# EAGLE design bridge-pcb (EAGLE 7.7.0)
REVISION: A
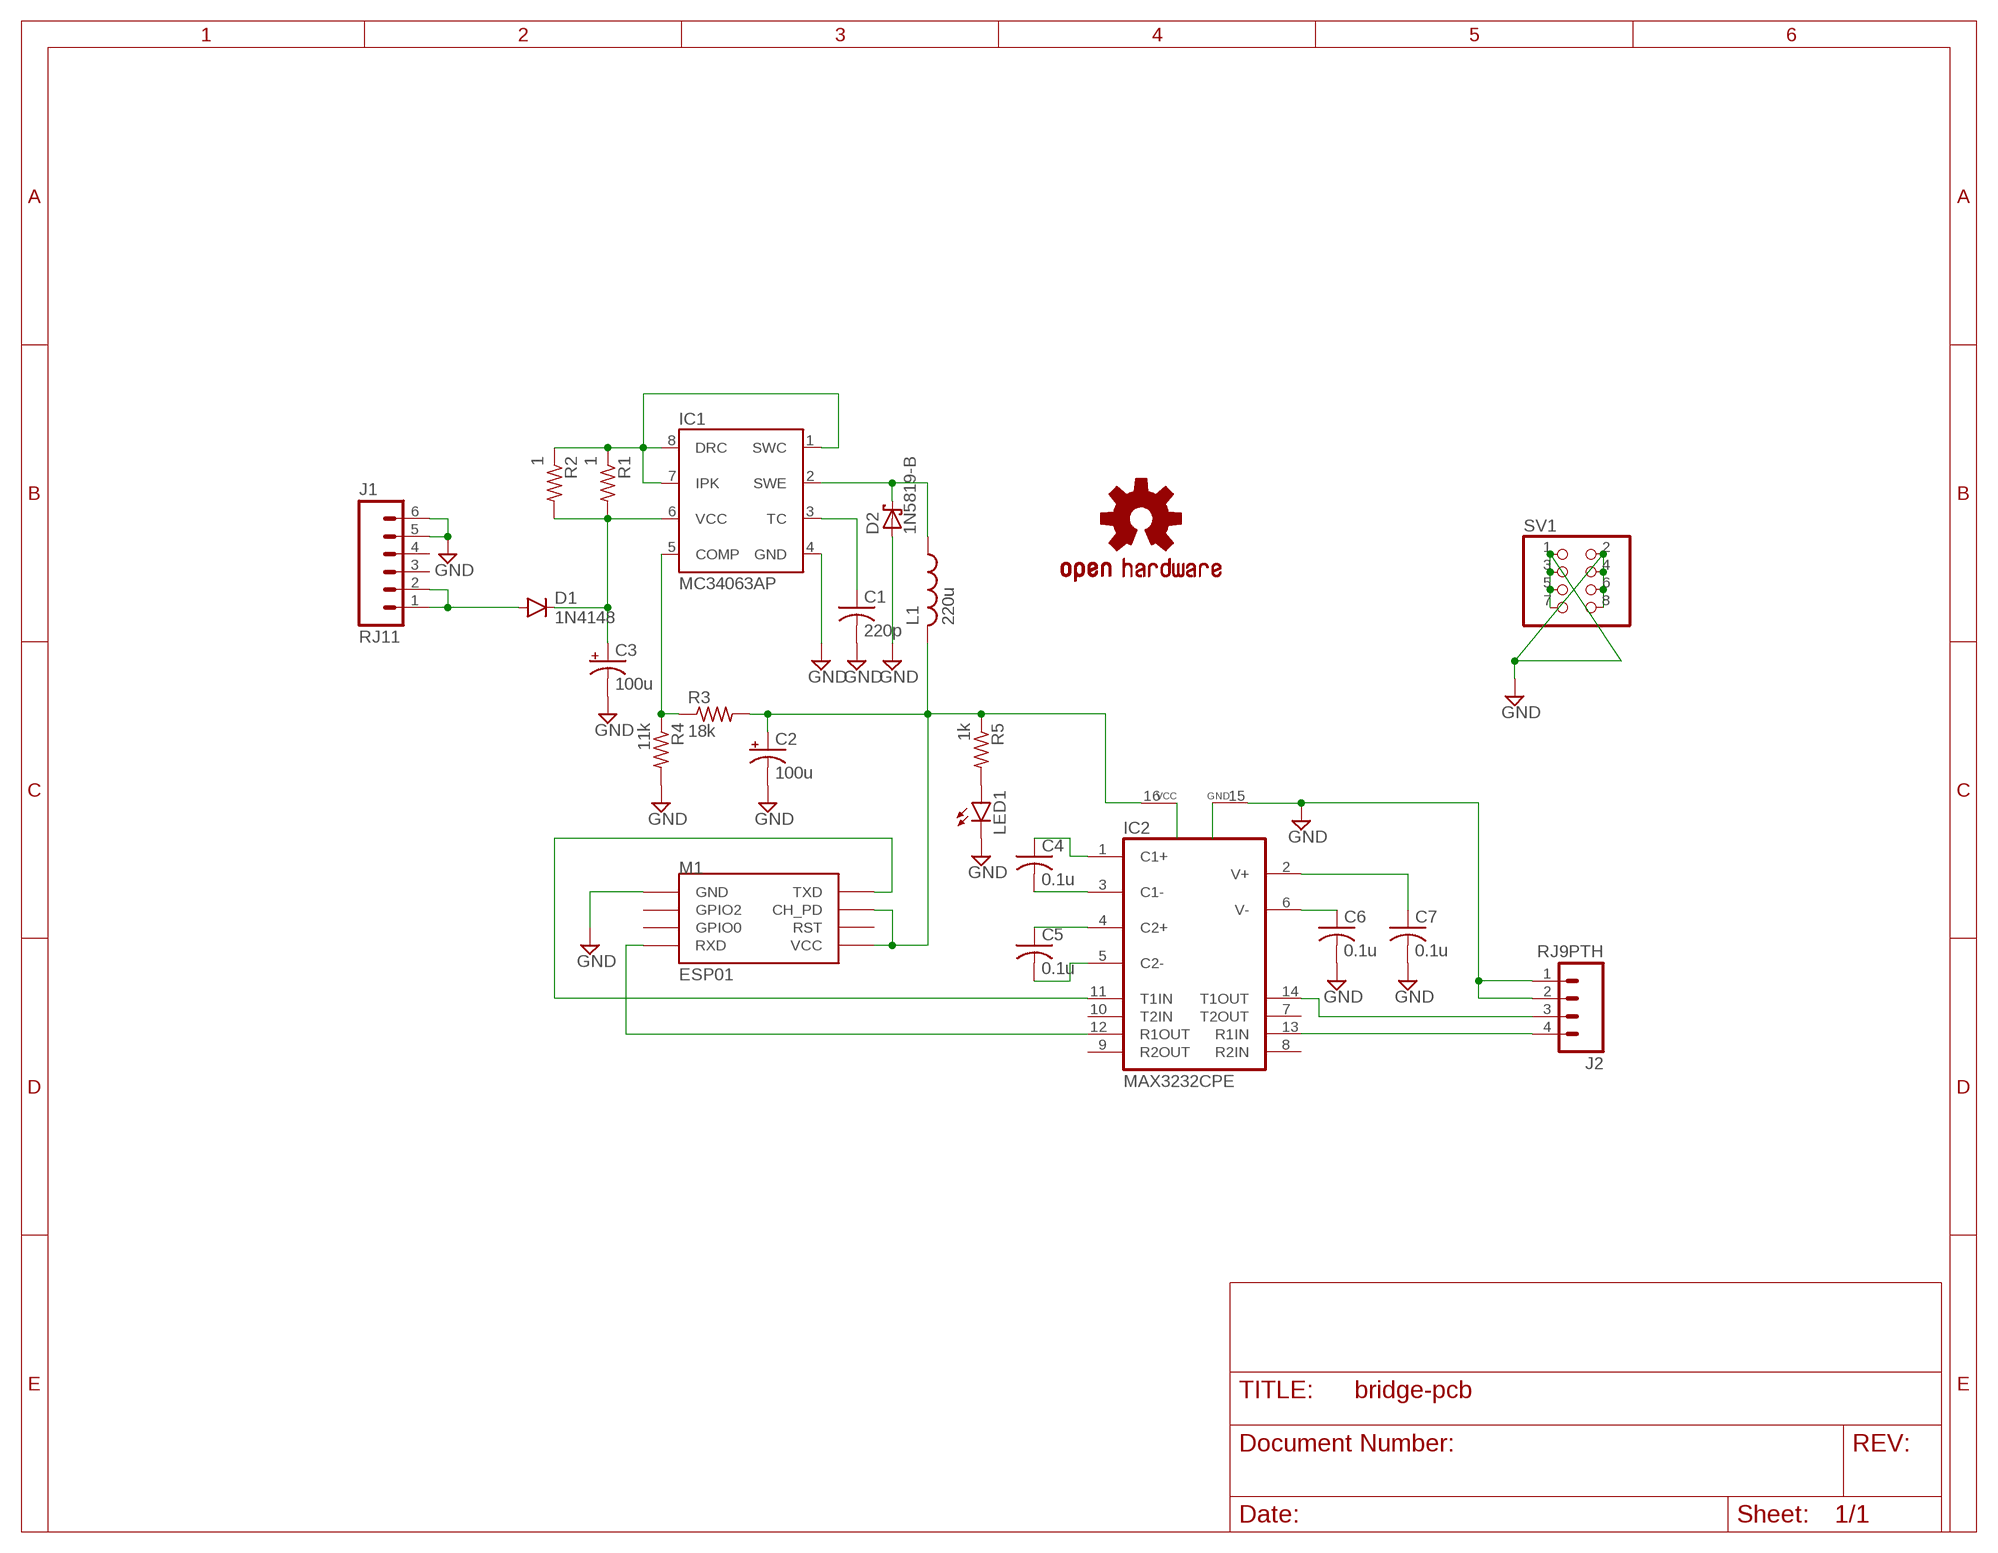
[diagram p0: schematic, sheet 1]
FRAME1 (FRAME_A_L): DESCRIPTION: Wi-Fi to RS-232 bridge; REVISION: A

## Parts
C1  220p  C-US025-024X044  [C025-024X044]
C2  100u  CPOL-USE2.5-5  [E2,5-5]
C3  100u  CPOL-USE2.5-5  [E2,5-5]
C4  0.1u  C-US025-024X044  [C025-024X044]
C5  0.1u  C-US025-024X044  [C025-024X044]
C6  0.1u  C-US025-024X044  [C025-024X044]
C7  0.1u  C-US025-024X044  [C025-024X044]
D1  1N4148  DIODE1N4148  [DIODE-1N4148]
D2  1N5819-B  [DO41-7.6]
IC1  MC34063AP  [DIL-08]
IC2  MAX3232CPE  [DIL16]
J1  RJ11  RJ11-6PTH  [RJ11-6]
J2  RJ9PTH  [RJ9]
L1  220u  L-US6000-XXX-RC  [6000-XXXX-RC]
LED1  LED5MM  [LED5MM]
LOGO1  OSHW-LOGOM  [OSHW-LOGO-M]
M1  ESP01  [ESP01]
R1  1  R-US_0204/2V  [0204V]
R2  1  R-US_0204/2V  [0204V]
R3  18k  R-US_0204/2V  [0204V]
R4  11k  R-US_0204/2V  [0204V]
R5  1k  R-US_0204/7  [0204/7]
SV1  PINHD-2X4  [2X04]

## Nets
3V3 [supply]: C2.+ IC2.16(VCC) L1.2 M1.CH_PD M1.VCC R3.2 R5.1
12V [supply]: C3.+ D1.C IC1.6(VCC) R1.2 R2.2
GND: C1.2 C2.- C3.- C6.2 C7.2 D2.A IC1.4(GND) IC2.15(GND) J1.5 J1.6 J2.1 J2.2 LED1.K(C) M1.GND R4.2 SV1.1 SV1.2 SV1.3 SV1.4 SV1.5 SV1.6 SV1.7 SV1.8
N$3: C1.1 IC1.3(TC)
N$4: LED1.A R5.2
N$5: D2.C IC1.2(SWE) L1.1
N$6: IC2.11(T1IN) M1.TX(TXD)
N$7: IC2.12(R1OUT) M1.RX(RXD)
N$8: C4.2 IC2.3(C1-)
N$9: C4.1 IC2.1(C1+)
N$10: C5.1 IC2.4(C2+)
N$11: C5.2 IC2.5(C2-)
N$12: C6.1 IC2.6(V-)
N$13: C7.1 IC2.2(V+)
N$14: IC2.14(T1OUT) J2.3
N$15: IC2.13(R1IN) J2.4
N$16: IC1.1(SWC) IC1.7(IPK) IC1.8(DRC) R1.1 R2.1
N$18: IC1.5(COMP) R3.1 R4.1
VBATT [supply]: D1.A J1.1 J1.2
Unconnected: IC2.7(T2OUT) IC2.8(R2IN) IC2.9(R2OUT) IC2.10(T2IN) J1.3 J1.4 M1.GPIO0 M1.GPIO2 M1.RST

## Library data of the parts
C1 C4-C7 = rcl:C-US: CAPACITOR, American symbol
C2 C3 = rcl:CPOL-US: POLARIZED CAPACITOR, American symbol
D1 = SparkFun-DiscreteSemi:DIODE: Diode These are standard reverse protection diodes and small signal diodes. SMA package can handle up to about 1A. SOD-323 can handle about 200mA. What the SOD-323 package when ordering, there are some mfgs out there that are 5-pin packages.
D2 = diode:1N581*: 1.0A SCHOTTKY BARRIER RECTIFIER Source: http://www.diodes.com/datasheets/ds23001.pdf
IC1 = v-reg-3:MC34063A: 1.5A Step-Up/Down/Inverting Switching Regulator NPN Darlington Switch, Vin 3V to 40V, Current Limiter Input, adjustable Frequency up to 100kHz
IC2 = maxim:MAX3232*: True RS-232 Transceivers 3.0V to 5.5V, Low-Power up to 1Mbps, Using Four 0.1µF External Capacitors Source: http://pdfserv.maxim-ic.com/en/ds/MAX3222-MAX3241.pdf; MF: MAXIM; MPN: MAX3232CPE+; OC_FARNELL: 9724494; OC_NEWARK: 68K4626
J1 = SparkFun-Connectors:RJ11-6: RJ11 Jack Simple 6 pin RJ11 jack. Commonly found on CAT3 devices and Microchip programmers. SKU: PRT-00132; PROD_ID: CONN-08590
J2 = SparkFun-Connectors:RJ9: RJ9 connector (e.g., phone handsets)
L1 = rcl:L-US: INDUCTOR, American symbol
LED1 = SparkFun-LED:LED: LEDs Standard schematic elements and footprints for 5mm, 3mm, 1206, and 0603 sized LEDs. 5mm - Spark Fun Electronics SKU : COM-00529 (and others)
LOGO1 = SparkFun-Aesthetics:OSHW-LOGO: Open Source Hardware Logo This logo indicates the piece of hardware it is found on incorporates a OSHW license and/or adheres to the definition of open source hardware found here: http://freedomdefined.org/OSHW
M1 = esp8266modules:ESP01: ESP8266 Wifi module 01
R1-R5 = rcl:R-US_: RESISTOR, American symbol
SV1 = pinhead:PINHD-2X4: PIN HEADER

## Net classes
0 default: drill 0.61 mm
1 supply: width 0.61 mm, clearance 0.305 mm
2 grounds: width 0.61 mm, clearance 0.305 mm

## Board
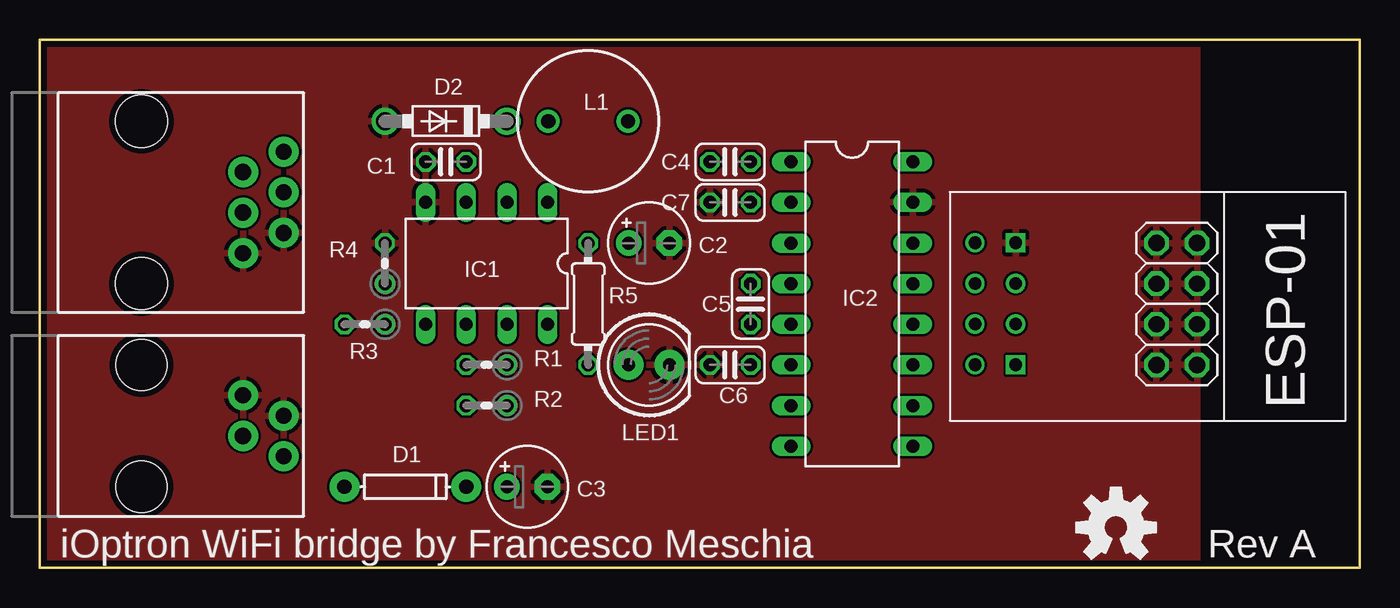
[diagram p1: board, top side]
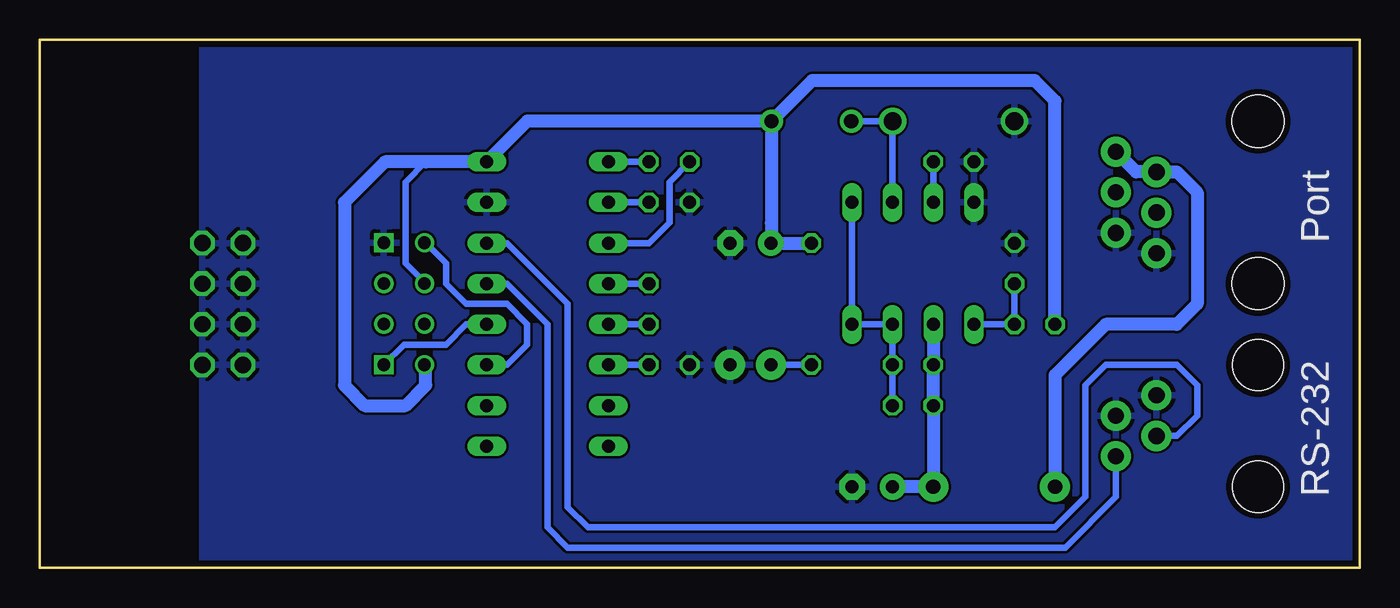
[diagram p2: board, bottom side, seen from below]

Size 82.55 x 33.02 mm. Coordinates in mm from the lower left corner, seen from the top.
Outline: 0,33.02 0,0 82.55,0 82.55,33.02 0,33.02
Copper layers (1*16): Top 0.035559375mm / dielectric 1.6mm / Bottom 0.035559375mm
Design rules "oshpark-2layer": minimum track width 6mil, minimum drill 10mil, track to track 6mil, track to pad 6mil, pad to pad 6mil, via to via 6mil, smd to smd 6mil, copper to edge 15mil, drill to drill 6mil, minimum pad ring 5mil, minimum via ring 5mil, stop-mask expansion 2.5mil, vias tented up to drill 0mil, thermal gap 10mil

### Footprints (pad centres in the part's own frame; a part is rotated, then mirrored left to right if it is on the bottom)
C025-024X044 = drill 0.813 octagon: 1 -1.27,0; 2 1.27,0
E2,5-5 = drill 0.813 pad 1.6: + -1.27,0 | drill 0.813 pad 1.6 octagon: - 1.27,0
DIODE-1N4148 = drill 0.9 pad 1.88: A -3.81,0; C 3.81,0
DO41-7.6 = drill 1.1 pad 1.7: A 3.81,0; C -3.81,0
DIL-08 = drill 0.813 long: 1 -3.81,-3.81; 2 -1.27,-3.81; 3 1.27,-3.81; 4 3.81,-3.81; 5 3.81,3.81; 6 1.27,3.81; 7 -1.27,3.81; 8 -3.81,3.81
DIL16 = drill 0.813 long: 1 -8.89,-3.81; 2 -6.35,-3.81; 3 -3.81,-3.81; 4 -1.27,-3.81; 5 1.27,-3.81; 6 3.81,-3.81; 7 6.35,-3.81; 8 8.89,-3.81; 9 8.89,3.81; 10 6.35,3.81; 11 3.81,3.81; 12 1.27,3.81; 13 -1.27,3.81; 14 -3.81,3.81; 15 -6.35,3.81; 16 -8.89,3.81
RJ11-6 = drill 1.016 pad 1.88: 1 -3.175,8.89; 2 -1.905,6.35; 3 -0.635,8.89; 4 0.635,6.35; 5 1.905,8.89; 6 3.175,6.35 | hole 3.251: -5.08,0; 5.08,0
RJ9 = drill 1.016 pad 1.88: 1 -1.905,6.35; 2 -0.635,8.89; 3 0.635,6.35; 4 1.905,8.89 | hole 3.2: -3.81,0; 3.81,0
6000-XXXX-RC = drill 0.9 pad 1.422: 1 -2.5,0; 2 2.5,0
LED5MM = drill 0.813 pad 1.88: A -1.27,0; K 1.27,0
ESP01 = drill 0.8: CH_PD -1.285,-8.178; GPIO0 1.255,-5.638; GPIO2 -1.285,-5.638; RST 1.255,-8.178; TX -3.825,-8.178; VCC 3.795,-8.178 | drill 0.8 square: GND -3.825,-5.638; RX 3.795,-5.638
0204V = drill 0.813 octagon: 1 -1.27,0; 2 1.27,0
0204/7 = drill 0.813 octagon: 1 -3.81,0; 2 3.81,0
2X04 = drill 1.016 octagon: 1 -3.81,-1.27; 2 -3.81,1.27; 3 -1.27,-1.27; 4 -1.27,1.27; 5 1.27,-1.27; 6 1.27,1.27; 7 3.81,-1.27; 8 3.81,1.27

### Placement (x,y rotation side)
C1  25.4,25.4 180 top
C2  38.1,20.32 0 top
C3  30.48,5.08 0 top
C4  43.18,25.4 180 top
C5  44.45,16.51 270 top
C6  43.18,12.7 180 top
C7  43.18,22.86 180 top
D1  22.86,5.08 0 top
D2  25.4,27.94 180 top
IC1  27.94,19.05 180 top
IC2  50.8,16.51 270 top
J1  6.35,22.86 270 top
J2  6.35,8.89 270 top
L1  34.29,27.94 0 top
LED1  38.1,12.7 0 top
LOGO1  67.31,2.54 0 top
M1  66.67,16.51 270 top
R1  27.94,12.7 180 top
R2  27.94,10.16 180 top
R3  20.32,15.24 180 top
R4  21.59,19.05 90 top
R5  34.29,16.51 270 top
SV1  71.12,16.51 90 top

### Tracks (layer width: path | path; a pad name or v marks a point on that pad's centre or on a via)
3V3
  Bottom 0.406: 58.5,17.86 59.69,19.05 59.69,24.13 58.42,25.4
  Bottom 0.813: L1.2 36.79,21.59 C2.+ R5.1 | L1.2 52.07,27.94 IC2.16 58.42,25.4 60.96,25.4 63.5,22.86 63.5,11.43 62.23,10.16 59.69,10.16 58.42,11.43 58.42,12.64 M1.VCC 58.41,12.71 | R3.2 19.05,29.21 20.32,30.48 34.25,30.48 L1.2 | M1.CH_PD 58.5,17.86
12V
  Bottom 0.813: IC1.6 R1.2 R2.2 D1.C C3.+
GND
  pour Bottom: 0,33.02 72.39,33.02 72.39,0 0,0
  pour Top: 0,33.02 72.39,33.02 72.39,0 0,0
N$3
  Bottom 0.406: IC1.3 C1.1
N$4
  Bottom 0.406: R5.2 LED1.A
N$5
  Bottom 0.406: L1.1 D2.C IC1.2
N$6
  Bottom 0.406: M1.TX 58.44,20.34 57.15,19.05 57.15,17.78 55.88,16.51 53.34,16.51 52.07,15.24 52.07,13.97 53.34,12.7 IC2.11
N$7
  Bottom 0.406: IC2.12 55.88,15.24 57.15,13.97 59.78,13.97 M1.RX
N$8
  Bottom 0.406: IC2.3 44.45,20.32 43.18,21.59 43.18,24.13 C4.2
N$9
  Bottom 0.406: C4.1 IC2.1
N$10
  Bottom 0.406: C5.1 IC2.4
N$11
  Bottom 0.406: C5.2 IC2.5
N$12
  Bottom 0.406: C6.1 IC2.6
N$13
  Bottom 0.406: C7.1 IC2.2
N$14
  Bottom 0.406: IC2.14 53.34,20.32 49.53,16.51 49.53,3.81 48.26,2.54 19.05,2.54 17.14,4.45 17.14,11.43 15.88,12.7 11.43,12.7 10.16,11.43 10.16,9.53 11.43,8.26 J2.3
N$15
  Bottom 0.406: IC2.13 53.34,17.78 50.8,15.24 50.8,2.54 49.53,1.27 18.41,1.27 15.24,4.45 J2.4
N$16
  Bottom 0.406: IC1.1 IC1.8 IC1.7 R1.1 R2.1
N$18
  Bottom 0.406: R4.1 R3.1 IC1.5
VBATT
  Bottom 0.813: J1.1 13.97,24.77 J1.2 11.43,24.77 10.16,23.5 10.16,16.51 11.43,15.24 15.88,15.24 19.05,12.06 D1.A

### Text on the board
tNames: iOptron WiFi bridge by Francesco Meschia | Rev A
bNames: Port | RS-232